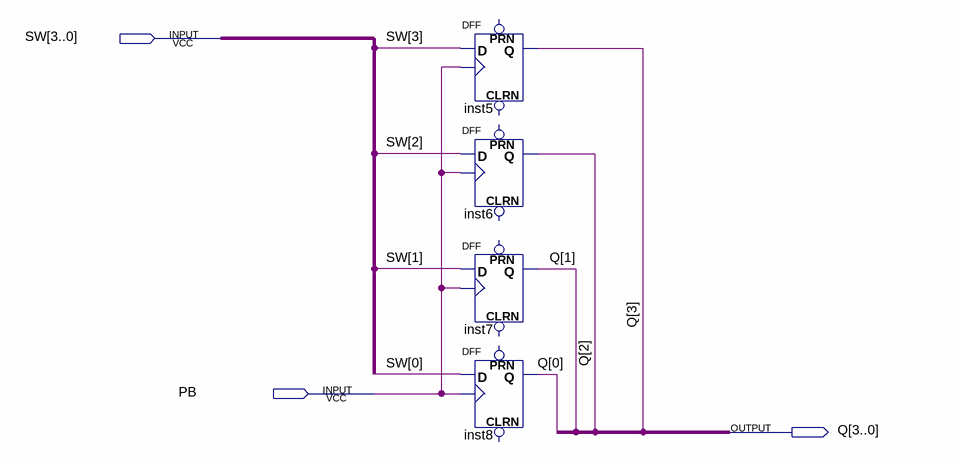
[diagram p0: schematic sheet]
// Quartus schematic REGISTRADOR4BITS.bdf as structural Verilog: 4 symbols, 3 pins
module REGISTRADOR4BITS (
  input  [3:0] SW,
  input  PB,
  output [3:0] Q
);

  DFF inst5 (.CLK(PB), .D(SW[3]), .Q(Q[3]));  // open: CLRN, PRN
  DFF inst6 (.CLK(PB), .D(SW[2]), .Q(Q[2]));  // open: CLRN, PRN
  DFF inst7 (.CLK(PB), .D(SW[1]), .Q(Q[1]));  // open: CLRN, PRN
  DFF inst8 (.CLK(PB), .D(SW[0]), .Q(Q[0]));  // open: CLRN, PRN
endmodule
